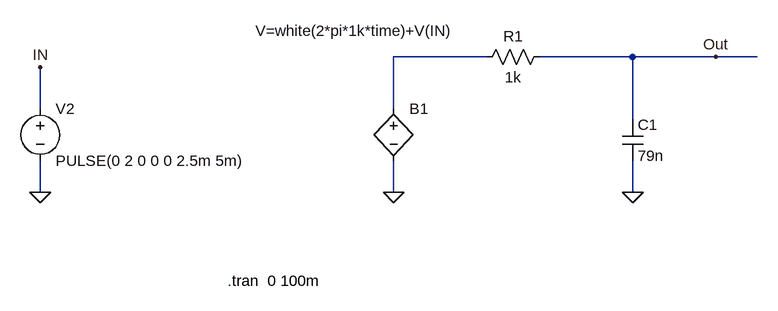
[diagram p0: schematic Draft2.asc]
Draft2.asc, the LTspice schematic file:
Version 4.1
SHEET 1 880 680
WIRE 320 32 176 32
WIRE 544 32 400 32
WIRE 672 32 544 32
WIRE 736 32 672 32
WIRE -368 112 -368 48
WIRE 176 112 176 32
WIRE 544 128 544 32
WIRE -368 240 -368 192
WIRE 176 240 176 192
WIRE 544 240 544 192
FLAG -368 240 0
FLAG 176 240 0
FLAG -368 48 IN
FLAG 544 240 0
FLAG 672 32 Out
SYMBOL bv 176 96 R0
WINDOW 3 91 -104 Right 2
SYMATTR InstName B1
SYMATTR Value V=white(2*pi*1k*time)+V(IN)
SYMBOL voltage -368 96 R0
WINDOW 123 0 0 Left 0
WINDOW 39 0 0 Left 0
SYMATTR InstName V2
SYMATTR Value PULSE(0 2 0 0 0 2.5m 5m)
SYMBOL res 416 16 R90
WINDOW 0 0 56 VBottom 2
WINDOW 3 32 56 VTop 2
SYMATTR InstName R1
SYMATTR Value 1k
SYMBOL cap 528 128 R0
SYMATTR InstName C1
SYMATTR Value 79n
TEXT -80 376 Left 2 !.tran  0 100m

The netlist it stands for:
* Draft2.asc
B1 N001 0 V=white(2*pi*1k*time)+V(IN)
V2 IN 0 PULSE(0 2 0 0 0 2.5m 5m)
R1 Out N001 1k
C1 Out 0 79n
.tran  0 100m
.backanno
.end